# Altium project Adapter_UNIT_SPI_TO_HDMI.PrjPcb
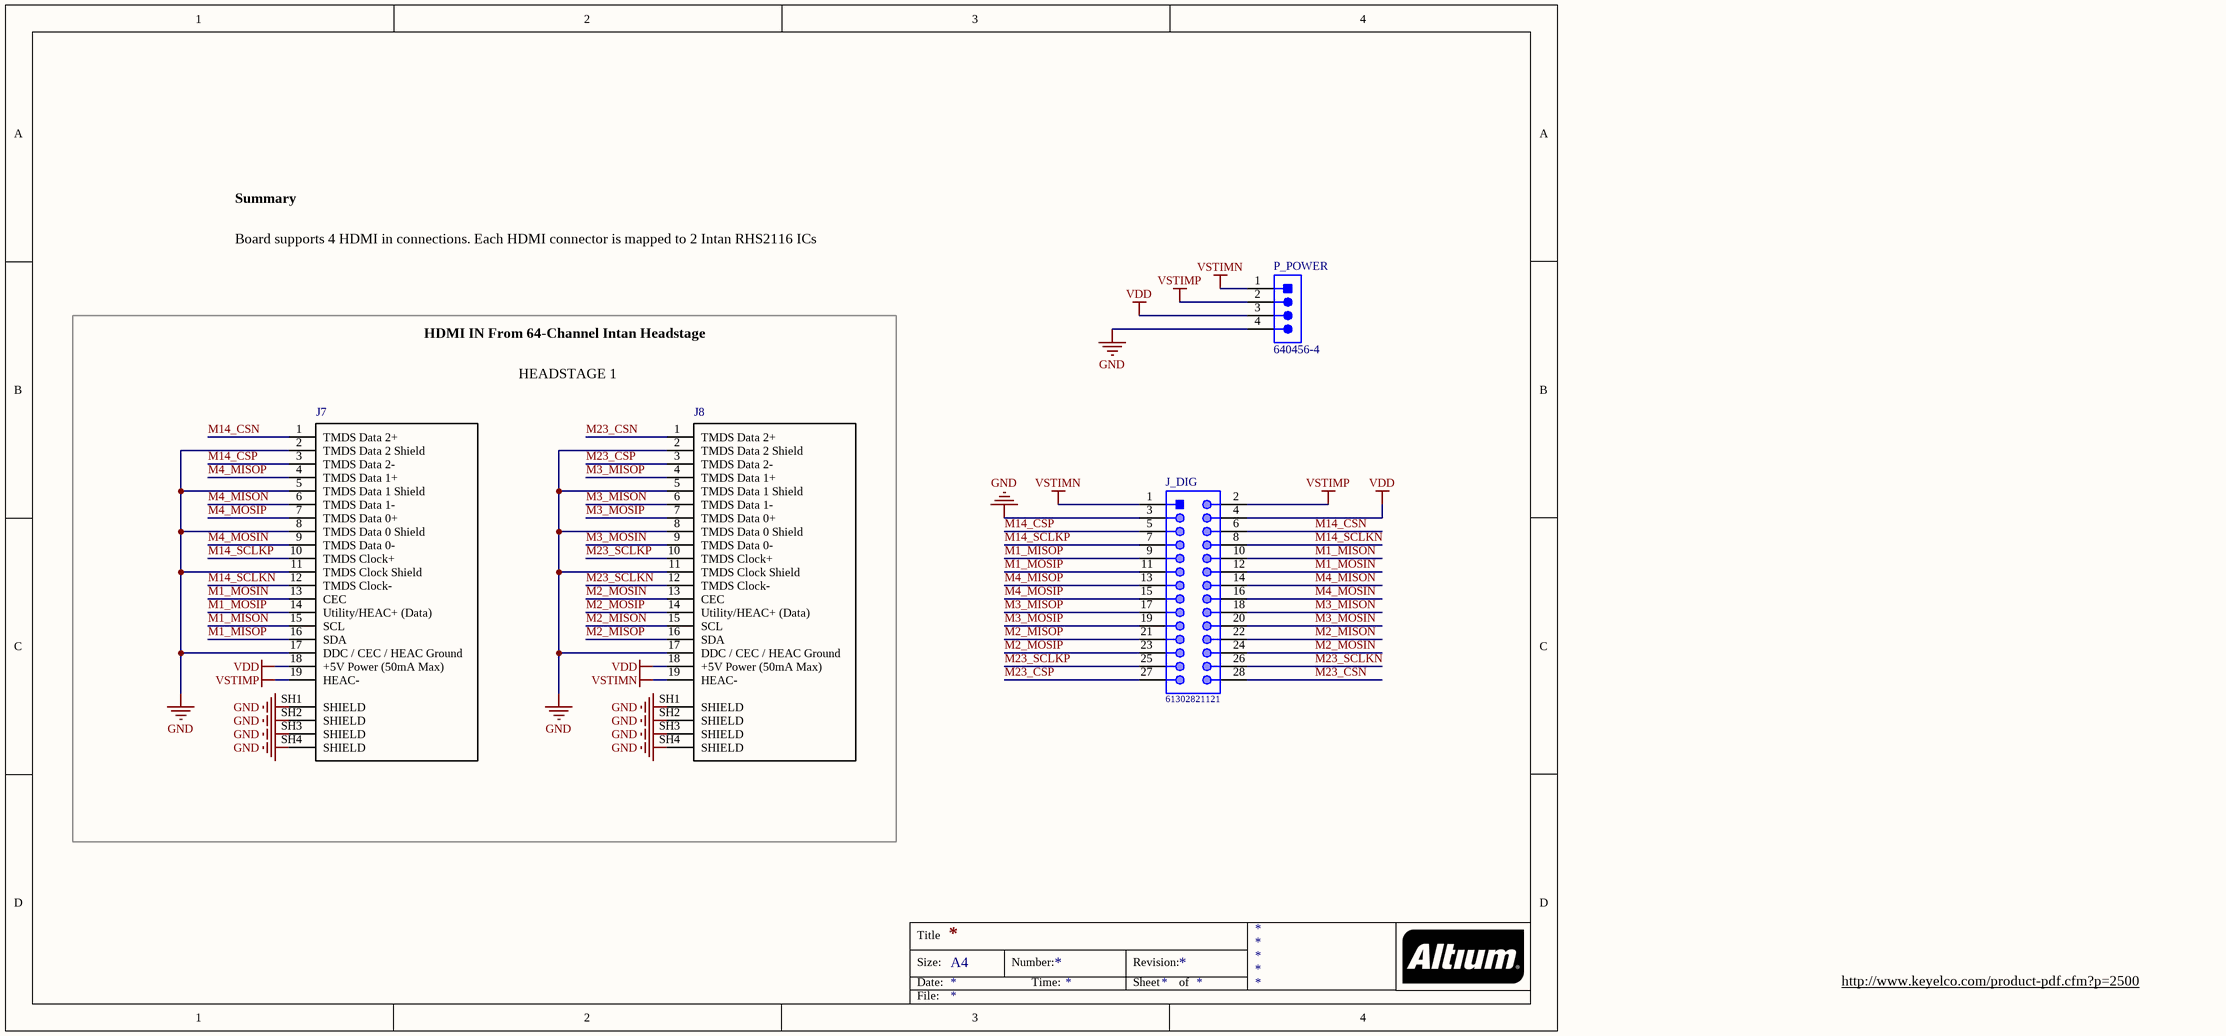
[diagram p0: Adapter_UNIT_SPI_TO_HDMI.SchDoc]
1 sheet, 4 parts. Net scope: global (net labels, ports and power ports of the same name join across sheets).
Board file: Adapter_UNIT_SPI_TO_HDMI.PcbDoc

## Sheet Adapter_UNIT_SPI_TO_HDMI.SchDoc
size A4

### Parts
J7  1747981-2  [TE_1747981-2_1747981-2(Primary)]  (value not drawn)
J8  1747981-2  [TE_1747981-2_1747981-2(Primary)]  (value not drawn)
J_DIG  61302821121  [61302821121]
P_POWER  640456-4  [TECO-640456-4]

### Nets
GND: J7.2(TMDS_Data_2_Shield) J7.5(TMDS_Data_1_Shield) J7.8(TMDS_Data_0_Shield) J7.11(TMDS_Clock_Shield) J7.17(DDC_/_CEC_/_HEAC_Ground) J7.SH1(SHIELD) J7.SH2(SHIELD) J7.SH3(SHIELD) J7.SH4(SHIELD) J8.2(TMDS_Data_2_Shield) J8.5(TMDS_Data_1_Shield) J8.8(TMDS_Data_0_Shield) J8.11(TMDS_Clock_Shield) J8.17(DDC_/_CEC_/_HEAC_Ground) J8.SH1(SHIELD) J8.SH2(SHIELD) J8.SH3(SHIELD) J8.SH4(SHIELD) J_DIG.3 P_POWER.4
VDD: J7.18(+5V_Power_(50mA_Max)) J8.18(+5V_Power_(50mA_Max)) J_DIG.4 P_POWER.3
VSTIMN: J8.19(HEAC-) J_DIG.1 P_POWER.1
VSTIMP: J7.19(HEAC-) J_DIG.2 P_POWER.2
M1_MISON: J7.15(SCL) J_DIG.10
M1_MISOP: J7.16(SDA) J_DIG.9
M1_MOSIN: J7.13(CEC) J_DIG.12
M1_MOSIP: J7.14(Utility/HEAC+_(Data)) J_DIG.11
M2_MISON: J8.15(SCL) J_DIG.22
M2_MISOP: J8.16(SDA) J_DIG.21
M2_MOSIN: J8.13(CEC) J_DIG.24
M2_MOSIP: J8.14(Utility/HEAC+_(Data)) J_DIG.23
M3_MISON: J8.6(TMDS_Data_1-) J_DIG.18
M3_MISOP: J8.4(TMDS_Data_1+) J_DIG.17
M3_MOSIN: J8.9(TMDS_Data_0-) J_DIG.20
M3_MOSIP: J8.7(TMDS_Data_0+) J_DIG.19
M4_MISON: J7.6(TMDS_Data_1-) J_DIG.14
M4_MISOP: J7.4(TMDS_Data_1+) J_DIG.13
M4_MOSIN: J7.9(TMDS_Data_0-) J_DIG.16
M4_MOSIP: J7.7(TMDS_Data_0+) J_DIG.15
M14_CSN: J7.1(TMDS_Data_2+) J_DIG.6
M14_CSP: J7.3(TMDS_Data_2-) J_DIG.5
M14_SCLKN: J7.12(TMDS_Clock-) J_DIG.8
M14_SCLKP: J7.10(TMDS_Clock+) J_DIG.7
M23_CSN: J8.1(TMDS_Data_2+) J_DIG.28
M23_CSP: J8.3(TMDS_Data_2-) J_DIG.27
M23_SCLKN: J8.12(TMDS_Clock-) J_DIG.26
M23_SCLKP: J8.10(TMDS_Clock+) J_DIG.25

### Notes on the sheet
- Summary
- Board supports 4 HDMI in connections. Each HDMI connector is mapped to 2 Intan RHS2116 ICs
- HDMI IN From 64-Channel Intan Headstage
- HEADSTAGE 1
- http://www.keyelco.com/product-pdf.cfm?p=2500
- Title
- Size:
- Date:
- A4
- Number:
- Time:
- Revision:
- Sheet
- of
- File:

### Library data of the parts
J7 J8 = 1747981-2: Conn HDMI RCP 19 POS 0.5mm Solder ST SMD 19 Terminal 1 Port T/R; MF: TE Connectivity; Detailed Description: HDMI Receptacle Connector 19 Position Panel Mount; Surface Mount, Right Angle; Through Hole; Pricing1: 1  6.31000  $6.31  10  6.04800  $60.48  25  5.54400  $138.60  50  5.29240  $264.62  100  5.04030  $504.03 (CAD); TE_purchase_URL: https://www.te.com/usa-en/product-1747981-2.html?te_bu=Cor&te_type=disp&te_campaign=seda_glo_cor-seda-global-disp-prtnr-fy19-seda-model-bom-cta_sma-317_1&elqCampaignId=32493; SnapEDA_Link: https://www.snapeda.com/parts/1747981-2/TE%20Connectivity%20AMP%20Connectors/view-part/?ref=snap; Package: None; MP: 1747981-2; EU_RoHS_Compliance: Compliant; Availability: Unavailable; Price: None; Value: *; ComponentLink1Description: Datasheet; ComponentLink1URL: https://www.te.com/commerce/DocumentDelivery/DDEController?Action=srchrtrv&DocNm=1747981&DocType=Customer+Drawing&DocLang=English; Manufacturer: TE Connectivity; Manufacturer Part Number: 1747981-2; Stock1: 1,426; Supplier 1: Digikey; Supplier Link 1: https://www.digikey.ca/product-detail/en/te-connectivity-amp-connectors/1747981-2/A130924CT-ND/8602669; Supplier Part Number 1: A130924CT-ND
J_DIG = CMP-1502-01115-1: THT Vertical Pin Header WR-PHD, Pitch 2.54 mm, Dual Row, 28 pins; Manufacturer: Wurth Elektronik; Pin Number: 28; Contact Resistance: 20mOhm; Withstanding Voltage: 500VAC; Pitch: 2.54mm; Gender: Male; Working Voltage: 250VAC; Rated Current: 3A; Package Reference: 61302821121; Part Number: 61302821121; Mounting Technology: THT; Packaging: Bag; Manufacturer URL: http://www.we-online.de; Row Number: Dual; Orientation: Vertical; Operating Temperature: -40to105degC; Datasheet URL: https://katalog.we-online.de/em/datasheet/6130xx21121.pdf; Publisher: WurthElektronik
P_POWER = CMP-2000-05419-1: Male Header, Pitch 2.54 mm, 1 x 4 Position, Height 10.03 mm, Tail Length 3.56 mm, RoHS, Bulk; Manufacturer: TE Connectivity; Material, Housing: Polyester; Primary Type: InterconnectSystem; Mount Angle: Vertical; Color, Housing: White; Current, Rating: 5 / A; Agency Approvals: CSA,UL; Contact Termination Area Plating: Tin; Temperature, Operating: -55to+105 / degC; Standards: RoHSCompliant,ELVCompliant,UL94V-0; Number of Positions: 4; Brand/Series: MTA-100Series; Angle: Straight; Pin Spacing: 0.1 / "; Material, Contact: CopperAlloy; Connector Type: MTA-100; Special Features: Pinstrip; Mounting Hole Size: 0.04 / "; Contact Centerline Spacing: 0.100 / in.; Voltage, Rating: 250 / V; Manufacturer URL: http://www.te.com/; Length, Pin: 0.14 / "; Length, Overall: 0.4 / "; Color: White; Flammability Rating: UL94V-0; Mounting Type: PCMount; Termination: Solder; Datasheet URL: https://datasheet.ciiva.com/16286/eng-ds-82056-mta-0608-16286228.pdf; Number of Contacts: 4; Contact Shape: Square; Contact Mating Area Plating: Tin; Length, Terminal Post: 0.14 / in.; Size, Post: 0.025 / in.; Contact Plating: Tin; Type: PCBPlug; Datasheet Version: Dec-14; Number of Rows: 1